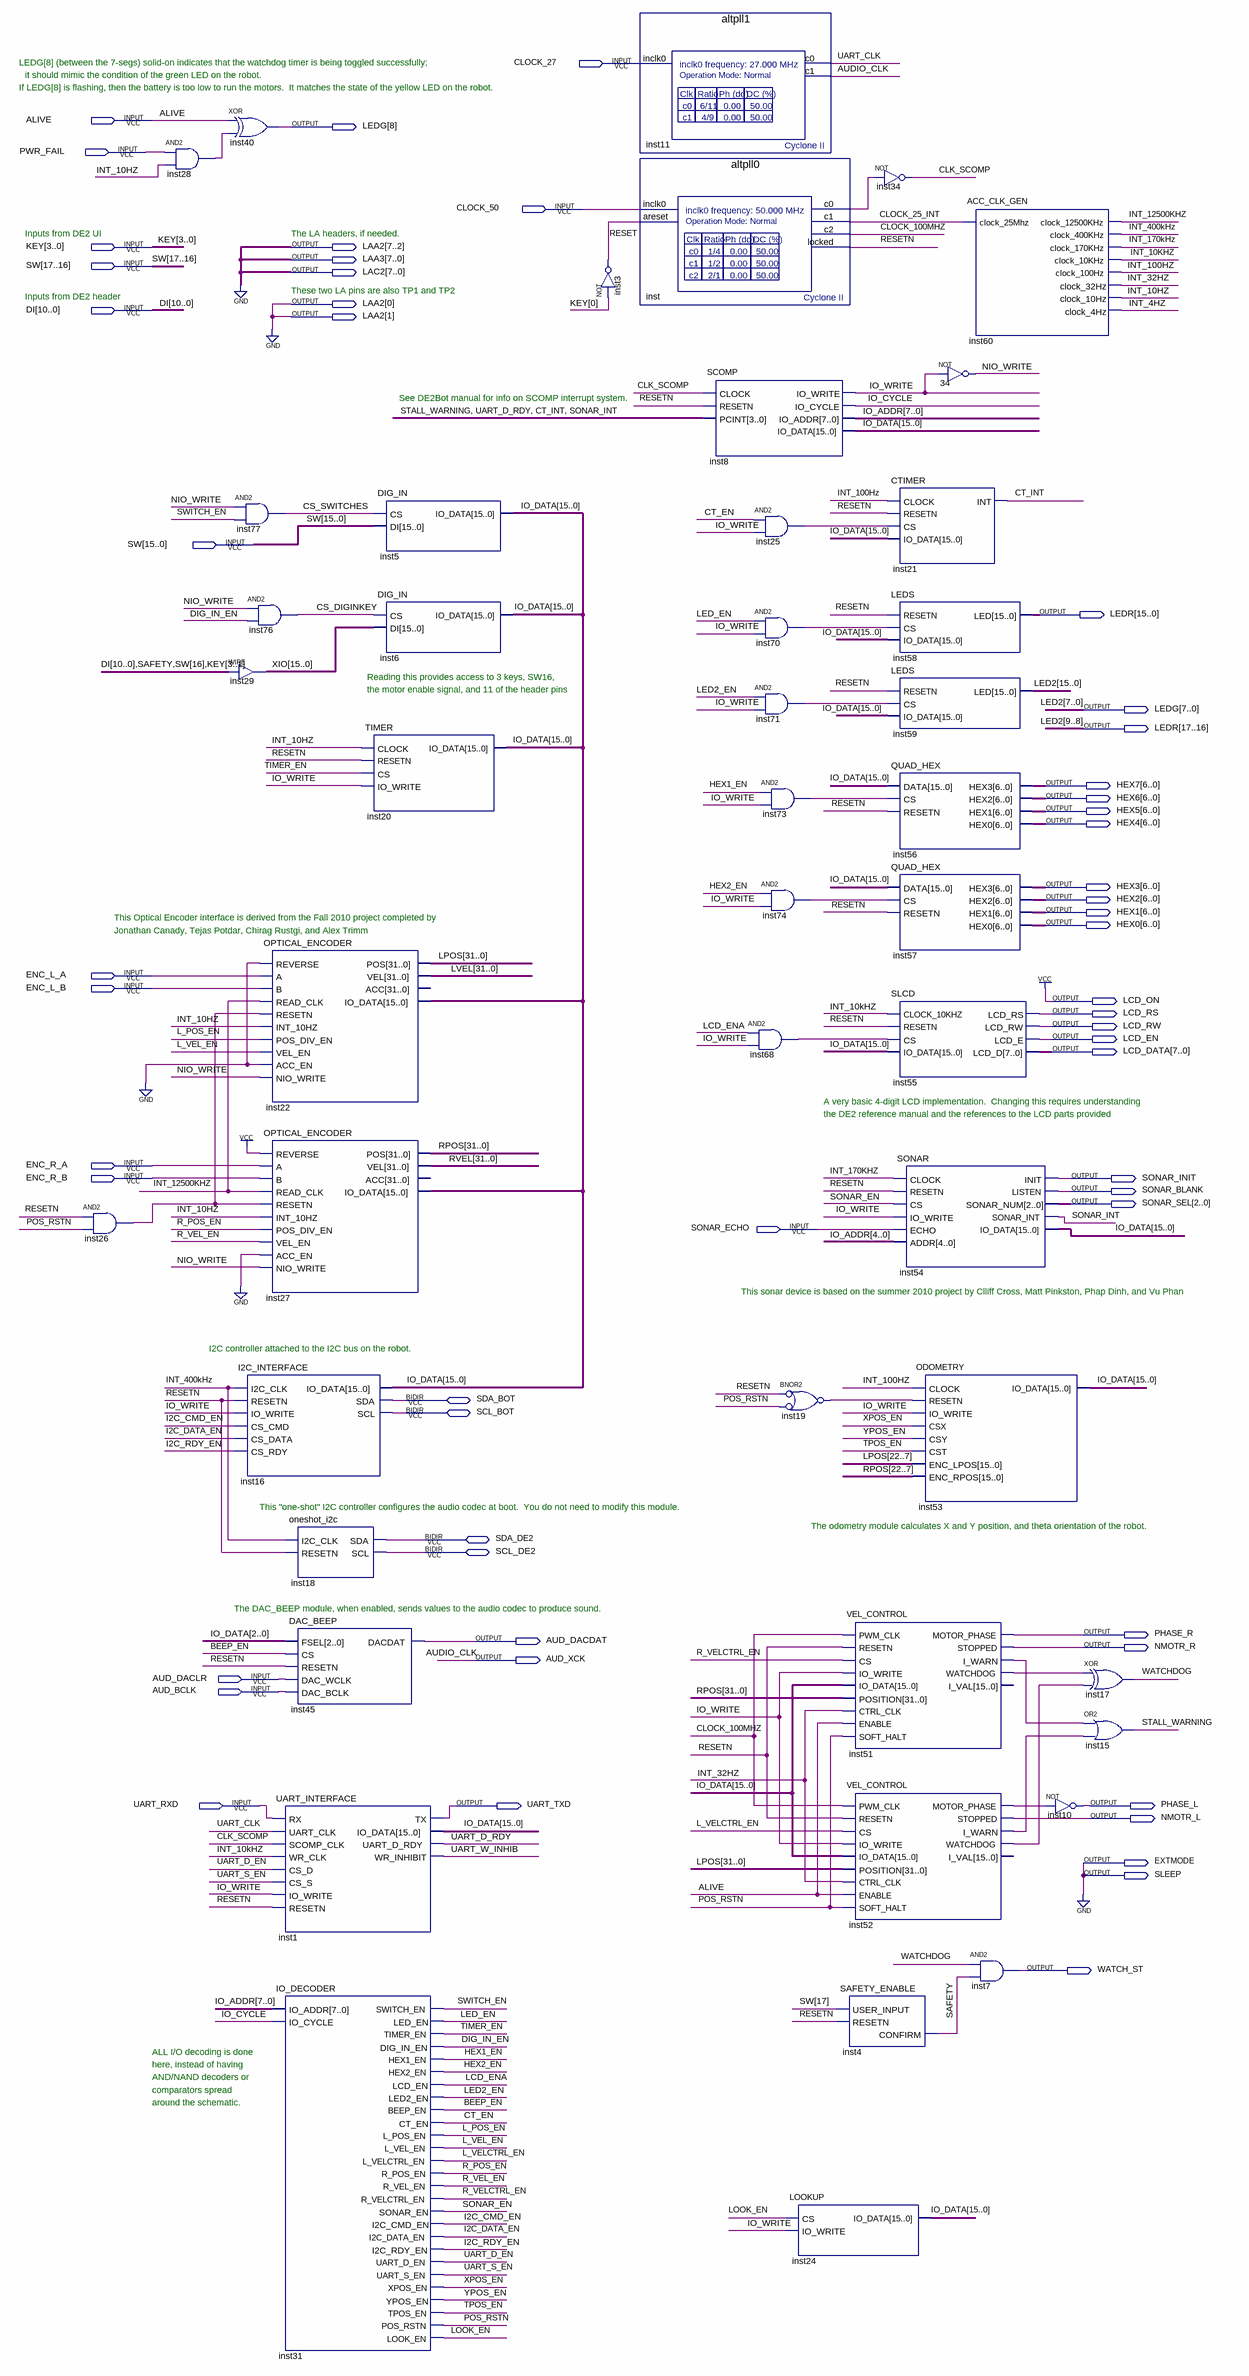
[diagram p0: schematic sheet]
// Quartus schematic DE2bot.bdf as structural Verilog: 46 symbols, 55 pins
module DE2bot (
  input  CLOCK_27,
  input  ALIVE,
  input  PWR_FAIL,
  input  CLOCK_50,
  input  [3:0] KEY,
  input  [17:0] SW,
  input  [10:0] DI,
  input  ENC_L_A,
  input  ENC_L_B,
  input  ENC_R_A,
  input  ENC_R_B,
  input  SONAR_ECHO,
  input  AUD_DACLR,
  input  AUD_BCLK,
  input  UART_RXD,
  inout  SDA_BOT,
  inout  SCL_BOT,
  inout  SDA_DE2,
  inout  SCL_DE2,
  output [8:0] LEDG,
  output [7:0] LAA2,
  output [7:0] LAA3,
  output [7:0] LAC2,
  output [17:0] LEDR,
  output [6:0] HEX7,
  output [6:0] HEX6,
  output [6:0] HEX5,
  output [6:0] HEX4,
  output [6:0] HEX3,
  output [6:0] HEX2,
  output [6:0] HEX1,
  output [6:0] HEX0,
  output LCD_ON,
  output LCD_RS,
  output LCD_RW,
  output LCD_EN,
  output [7:0] LCD_DATA,
  output SONAR_INIT,
  output SONAR_BLANK,
  output [2:0] SONAR_SEL,
  output PHASE_R,
  output AUD_DACDAT,
  output NMOTR_R,
  output AUD_XCK,
  output UART_TXD,
  output PHASE_L,
  output NMOTR_L,
  output EXTMODE,
  output SLEEP,
  output WATCH_ST
);

  wire BEEP_EN, CLK_SCOMP, CLOCK_25_INT, CLOCK_100MHZ, CS_DIGINKEY, CS_SWITCHES, CT_EN, CT_INT, DIG_IN_EN,
       HEX1_EN, HEX2_EN, I2C_CMD_EN, I2C_DATA_EN, I2C_RDY_EN, inst19_out, inst25_out, inst26_out, inst28_out,
       inst51_i_warn, inst51_watchdog, inst52_i_warn, inst52_motor_phase, inst52_watchdog, inst68_out,
       inst70_out, inst71_out, inst73_out, inst74_out, inst_c0, INT_4HZ, INT_10HZ, INT_10KHZ, INT_32HZ,
       INT_100HZ, INT_170kHz, INT_400kHz, INT_12500KHZ, IO_CYCLE, IO_WRITE, L_POS_EN, L_VEL_EN, L_VELCTRL_EN,
       LCD_ENA, LED2_EN, LED_EN, LOOK_EN, NIO_WRITE, POS_RSTN, R_POS_EN, R_VEL_EN, R_VELCTRL_EN, RESET,
       RESETN, SAFETY, SONAR_EN, SONAR_INT, STALL_WARNING, SWITCH_EN, TIMER_EN, TPOS_EN, UART_CLK, UART_D_EN,
       UART_D_RDY, UART_S_EN, UART_W_INHIB, WATCHDOG, XPOS_EN, YPOS_EN;
  wire [7:0] IO_ADDR;
  wire [15:0] IO_DATA, XIO;
  wire [15:10] LED2;
  wire [31:0] LPOS, LVEL, RPOS, RVEL;

  and inst26 (inst26_out, RESETN, POS_RSTN);
  and inst28 (inst28_out, PWR_FAIL, INT_10HZ);
  xor inst40 (LEDG[8], ALIVE, inst28_out);
  and inst77 (CS_SWITCHES, NIO_WRITE, SWITCH_EN);
  assign XIO = {DI, SAFETY, SW[16], KEY[3:1]};  // WIRE inst29
  I2C_INTERFACE inst16 (
    .I2C_CLK(INT_400kHz), .RESETN(RESETN), .IO_WRITE(IO_WRITE), .CS_CMD(I2C_CMD_EN), .CS_DATA(I2C_DATA_EN),
    .CS_RDY(I2C_RDY_EN), .IO_DATA(IO_DATA), .SDA(SDA_BOT), .SCL(SCL_BOT));
  and inst76 (CS_DIGINKEY, NIO_WRITE, DIG_IN_EN);
  OPTICAL_ENCODER inst22 (
    .REVERSE(1'b0), .A(ENC_L_A), .B(ENC_L_B), .READ_CLK(INT_12500KHZ), .RESETN(inst26_out),
    .INT_10HZ(INT_10HZ), .POS_DIV_EN(L_POS_EN), .VEL_EN(L_VEL_EN), .ACC_EN(1'b0), .NIO_WRITE(NIO_WRITE),
    .POS(LPOS), .VEL(LVEL), .IO_DATA(IO_DATA));  // open: ACC
  OPTICAL_ENCODER inst27 (
    .REVERSE(1'b1), .A(ENC_R_A), .B(ENC_R_B), .READ_CLK(INT_12500KHZ), .RESETN(inst26_out),
    .INT_10HZ(INT_10HZ), .POS_DIV_EN(R_POS_EN), .VEL_EN(R_VEL_EN), .ACC_EN(1'b0), .NIO_WRITE(NIO_WRITE),
    .POS(RPOS), .VEL(RVEL), .IO_DATA(IO_DATA));  // open: ACC
  oneshot_i2c inst18 (.I2C_CLK(INT_400kHz), .RESETN(RESETN), .SDA(SDA_DE2), .SCL(SCL_DE2));
  DAC_BEEP inst45 (
    .FSEL(IO_DATA[2:0]), .CS(BEEP_EN), .RESETN(RESETN), .DAC_WCLK(AUD_DACLR), .DAC_BCLK(AUD_BCLK),
    .DACDAT(AUD_DACDAT));
  UART_INTERFACE inst1 (
    .RX(UART_RXD), .UART_CLK(UART_CLK), .SCOMP_CLK(CLK_SCOMP), .WR_CLK(INT_10KHZ), .CS_D(UART_D_EN),
    .CS_S(UART_S_EN), .IO_WRITE(IO_WRITE), .RESETN(RESETN), .TX(UART_TXD), .UART_D_RDY(UART_D_RDY),
    .WR_INHIBIT(UART_W_INHIB), .IO_DATA(IO_DATA));
  IO_DECODER inst31 (
    .IO_ADDR(IO_ADDR), .IO_CYCLE(IO_CYCLE), .SWITCH_EN(SWITCH_EN), .LED_EN(LED_EN), .TIMER_EN(TIMER_EN),
    .DIG_IN_EN(DIG_IN_EN), .HEX1_EN(HEX1_EN), .HEX2_EN(HEX2_EN), .LCD_EN(LCD_ENA), .LED2_EN(LED2_EN),
    .BEEP_EN(BEEP_EN), .CT_EN(CT_EN), .L_POS_EN(L_POS_EN), .L_VEL_EN(L_VEL_EN), .L_VELCTRL_EN(L_VELCTRL_EN),
    .R_POS_EN(R_POS_EN), .R_VEL_EN(R_VEL_EN), .R_VELCTRL_EN(R_VELCTRL_EN), .SONAR_EN(SONAR_EN),
    .I2C_CMD_EN(I2C_CMD_EN), .I2C_DATA_EN(I2C_DATA_EN), .I2C_RDY_EN(I2C_RDY_EN), .UART_D_EN(UART_D_EN),
    .UART_S_EN(UART_S_EN), .XPOS_EN(XPOS_EN), .YPOS_EN(YPOS_EN), .TPOS_EN(TPOS_EN), .POS_RSTN(POS_RSTN),
    .LOOK_EN(LOOK_EN));
  DIG_IN inst5 (.CS(CS_SWITCHES), .DI(SW[15:0]), .IO_DATA(IO_DATA));
  DIG_IN inst6 (.CS(CS_DIGINKEY), .DI(XIO), .IO_DATA(IO_DATA));
  TIMER inst20 (.CLOCK(INT_10HZ), .RESETN(RESETN), .CS(TIMER_EN), .IO_WRITE(IO_WRITE), .IO_DATA(IO_DATA));
  not inst3 (RESET, KEY[0]);
  altpll1 inst11 (.inclk0(CLOCK_27), .c0(UART_CLK), .c1(AUD_XCK));
  altpll0 inst (.inclk0(CLOCK_50), .areset(RESET), .c0(inst_c0), .c1(CLOCK_25_INT), .c2(CLOCK_100MHZ), .locked(RESETN));
  SCOMP inst8 (
    .CLOCK(CLK_SCOMP), .RESETN(RESETN), .PCINT({STALL_WARNING, UART_D_RDY, CT_INT, SONAR_INT}),
    .IO_WRITE(IO_WRITE), .IO_CYCLE(IO_CYCLE), .IO_ADDR(IO_ADDR), .IO_DATA(IO_DATA));
  and inst68 (inst68_out, LCD_ENA, IO_WRITE);
  and inst25 (inst25_out, CT_EN, IO_WRITE);
  and inst70 (inst70_out, LED_EN, IO_WRITE);
  and inst71 (inst71_out, LED2_EN, IO_WRITE);
  and inst73 (inst73_out, HEX1_EN, IO_WRITE);
  and inst74 (inst74_out, HEX2_EN, IO_WRITE);
  nor inst19 (inst19_out, ~RESETN, ~POS_RSTN);  // BNOR2
  LOOKUP inst24 (.CS(LOOK_EN), .IO_WRITE(IO_WRITE), .IO_DATA(IO_DATA));
  VEL_CONTROL inst51 (
    .PWM_CLK(CLOCK_100MHZ), .RESETN(RESETN), .CS(R_VELCTRL_EN), .IO_WRITE(IO_WRITE), .IO_DATA(IO_DATA),
    .POSITION(RPOS), .CTRL_CLK(INT_32HZ), .ENABLE(ALIVE), .SOFT_HALT(POS_RSTN), .MOTOR_PHASE(PHASE_R),
    .STOPPED(NMOTR_R), .I_WARN(inst51_i_warn), .WATCHDOG(inst51_watchdog));  // open: I_VAL
  VEL_CONTROL inst52 (
    .PWM_CLK(CLOCK_100MHZ), .RESETN(RESETN), .CS(L_VELCTRL_EN), .IO_WRITE(IO_WRITE), .IO_DATA(IO_DATA),
    .POSITION(LPOS), .CTRL_CLK(INT_32HZ), .ENABLE(ALIVE), .SOFT_HALT(POS_RSTN),
    .MOTOR_PHASE(inst52_motor_phase), .STOPPED(NMOTR_L), .I_WARN(inst52_i_warn), .WATCHDOG(inst52_watchdog));  // open: I_VAL
  SAFETY_ENABLE inst4 (.USER_INPUT(SW[17]), .RESETN(RESETN), .CONFIRM(SAFETY));
  not inst34 (CLK_SCOMP, inst_c0);
  CTIMER inst21 (.CLOCK(INT_100HZ), .RESETN(RESETN), .CS(inst25_out), .IO_DATA(IO_DATA), .INT(CT_INT));
  LEDS inst58 (.RESETN(RESETN), .CS(inst70_out), .IO_DATA(IO_DATA), .LED(LEDR[15:0]));
  LEDS inst59 (.RESETN(RESETN), .CS(inst71_out), .IO_DATA(IO_DATA), .LED({LED2, LEDR[17:16], LEDG[7:0]}));
  QUAD_HEX inst56 (
    .DATA(IO_DATA), .CS(inst73_out), .RESETN(RESETN), .HEX3(HEX7), .HEX2(HEX6), .HEX1(HEX5), .HEX0(HEX4));
  QUAD_HEX inst57 (
    .DATA(IO_DATA), .CS(inst74_out), .RESETN(RESETN), .HEX3(HEX3), .HEX2(HEX2), .HEX1(HEX1), .HEX0(HEX0));
  SLCD inst55 (
    .CLOCK_10KHZ(INT_10KHZ), .RESETN(RESETN), .CS(inst68_out), .IO_DATA(IO_DATA), .LCD_RS(LCD_RS),
    .LCD_RW(LCD_RW), .LCD_E(LCD_EN), .LCD_D(LCD_DATA));
  SONAR inst54 (
    .CLOCK(INT_170kHz), .RESETN(RESETN), .CS(SONAR_EN), .IO_WRITE(IO_WRITE), .ECHO(SONAR_ECHO),
    .ADDR(IO_ADDR[4:0]), .INIT(SONAR_INIT), .LISTEN(SONAR_BLANK), .SONAR_NUM(SONAR_SEL),
    .SONAR_INT(SONAR_INT), .IO_DATA(IO_DATA));
  not u_34 (NIO_WRITE, IO_WRITE);
  ODOMETRY inst53 (
    .CLOCK(INT_100HZ), .RESETN(inst19_out), .IO_WRITE(IO_WRITE), .CSX(XPOS_EN), .CSY(YPOS_EN), .CST(TPOS_EN),
    .ENC_LPOS(LPOS[22:7]), .ENC_RPOS(RPOS[22:7]), .IO_DATA(IO_DATA));
  ACC_CLK_GEN inst60 (
    .clock_25Mhz(CLOCK_25_INT), .clock_12500KHz(INT_12500KHZ), .clock_400KHz(INT_400kHz),
    .clock_170KHz(INT_170kHz), .clock_10KHz(INT_10KHZ), .clock_100Hz(INT_100HZ), .clock_32Hz(INT_32HZ),
    .clock_10Hz(INT_10HZ), .clock_4Hz(INT_4HZ));
  and inst7 (WATCH_ST, WATCHDOG, SAFETY);
  not inst10 (PHASE_L, inst52_motor_phase);
  xor inst17 (WATCHDOG, inst51_watchdog, inst52_watchdog);
  or inst15 (STALL_WARNING, inst51_i_warn, inst52_i_warn);

  assign EXTMODE = 1'b0;
  assign LAA2[1:0] = 2'b00;
  assign LAA3 = {8{1'b0}};
  assign LAC2 = {8{1'b0}};
  assign LCD_ON = 1'b1;
  assign SLEEP = 1'b0;

  // Other names for the same wires on the sheet: AUDIO_CLK = AUD_XCK; LED2[9:0] = {LEDR[17:16], LEDG[7:0]}

  // Notes on the sheet:
  //   LEDG[8] (between the 7-segs) solid-on indicates that the watchdog timer is being toggled successfully;
  //   it should mimic the condition of the green LED on the robot.
  //   If LEDG[8] is flashing, then the battery is too low to run the motors.  It matches the state of the yellow LED on the robot.
  //   Inputs from DE2 UI
  //   The LA headers, if needed.
  //   These two LA pins are also TP1 and TP2
  //   Inputs from DE2 header
  //   See DE2Bot manual for info on SCOMP interrupt system.
  //   Reading this provides access to 3 keys, SW16,
  //   the motor enable signal, and 11 of the header pins
  //   This Optical Encoder interface is derived from the Fall 2010 project completed by
  //   Jonathan Canady, Tejas Potdar, Chirag Rustgi, and Alex Trimm
  //   A very basic 4-digit LCD implementation.  Changing this requires understanding
  //   the DE2 reference manual and the references to the LCD parts provided
  //   This sonar device is based on the summer 2010 project by Clliff Cross, Matt Pinkston, Phap Dinh, and Vu Phan
  //   I2C controller attached to the I2C bus on the robot.
  //   This "one-shot" I2C controller configures the audio codec at boot.  You do not need to modify this module.
  //   The odometry module calculates X and Y position, and theta orientation of the robot.
  //   The DAC_BEEP module, when enabled, sends values to the audio codec to produce sound.
  //   ALL I/O decoding is done
  //   here, instead of having
  //   AND/NAND decoders or
  //   comparators spread
  //   around the schematic.
endmodule
